# Altium project Auxiliary PDU.PrjPcb
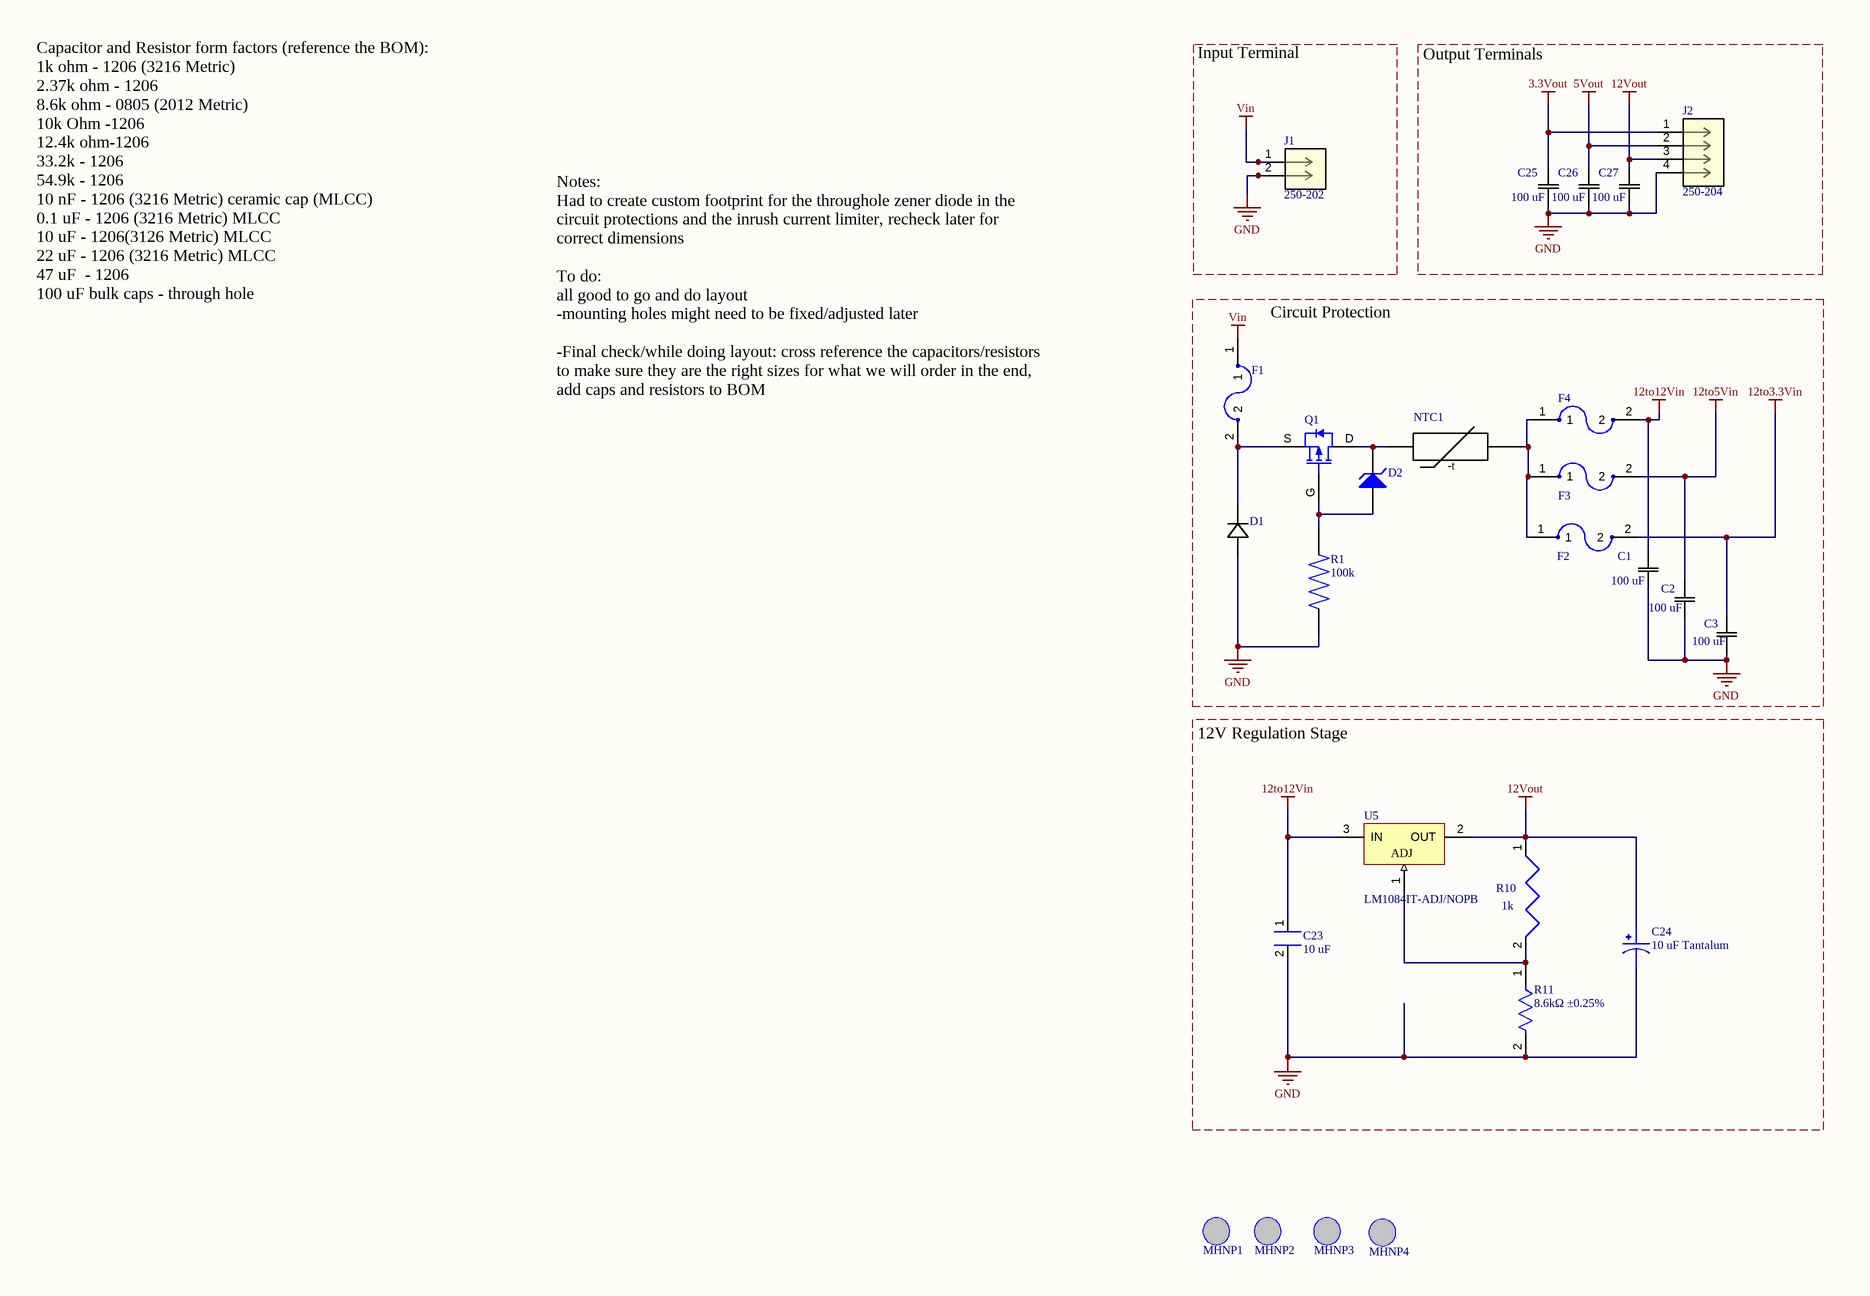
[diagram p0: AuxPDU.SchDoc, left]
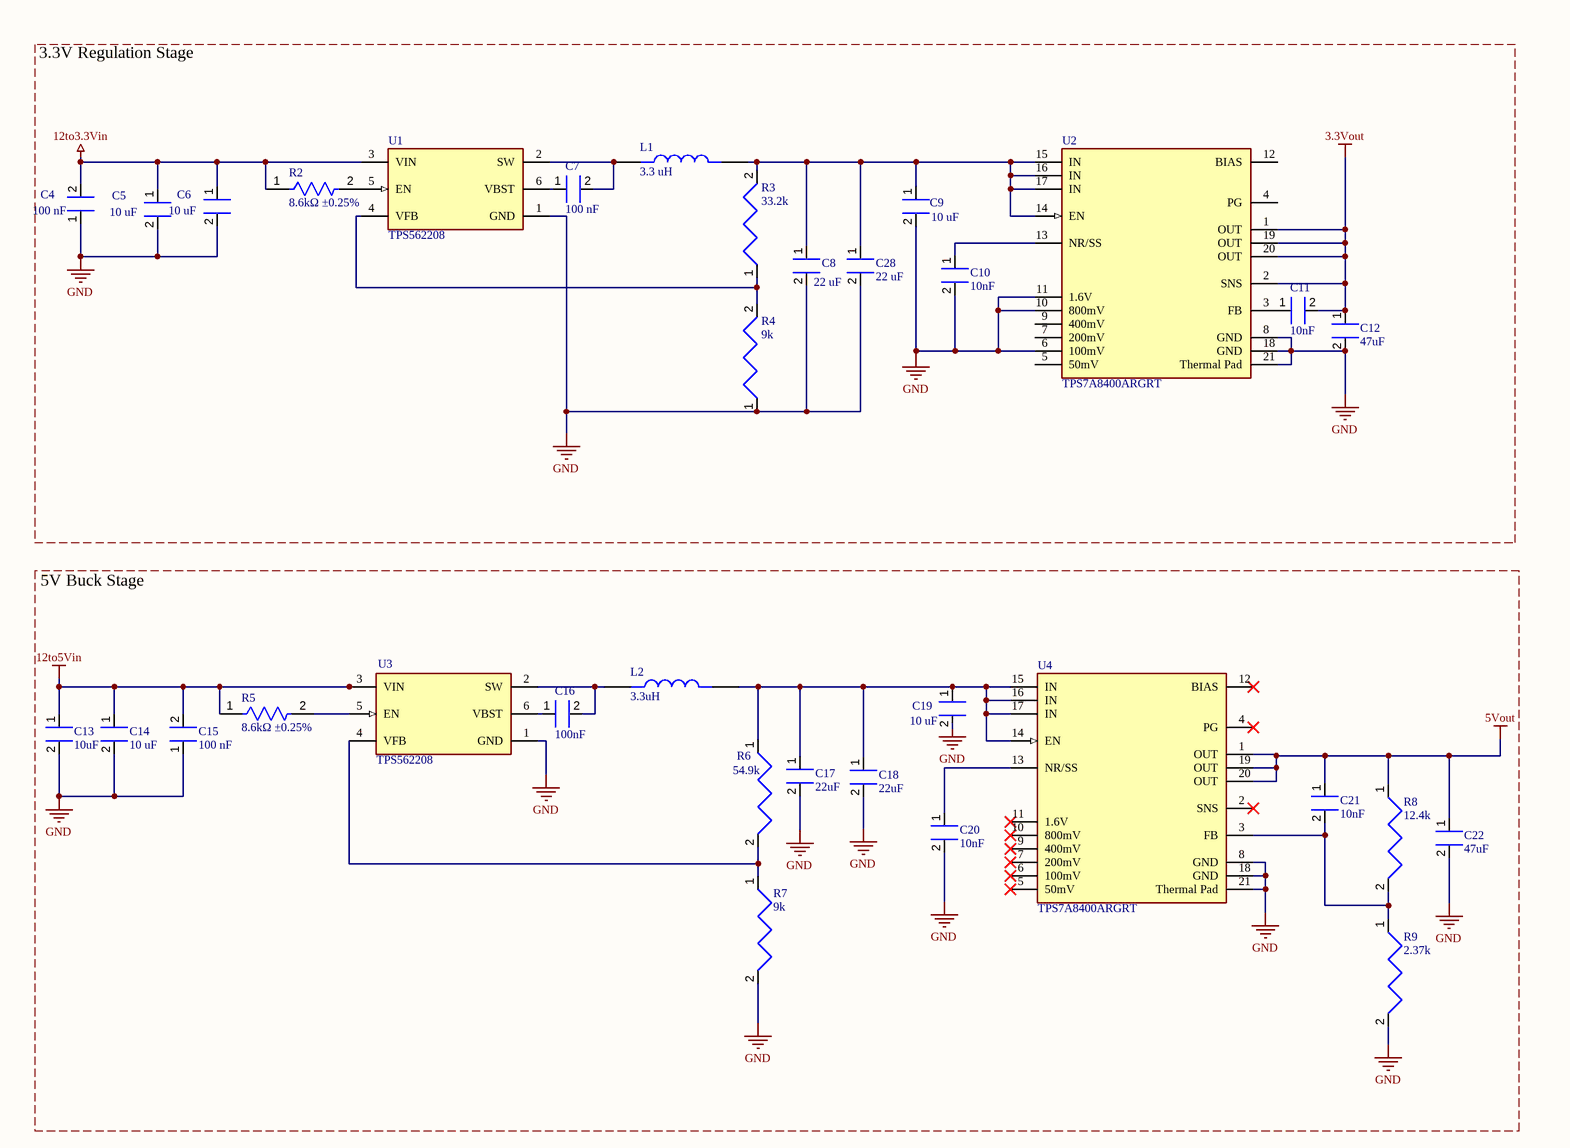
[diagram p1: AuxPDU.SchDoc, right]
1 sheet, 60 parts. Net scope: global (net labels, ports and power ports of the same name join across sheets).
Board files: AuxPDU_PatricksDesign.PcbDoc, AuxPDU.PcbDoc

## Sheet AuxPDU.SchDoc: Auxiliary Power Module
size 431 x 279 mm; Author: Patrick Nguyen , Angel Conde; CompanyName: CPP Solar Boat Club; Revision: A; SheetNumber: 1; SheetTotal: 1

### Parts
C1  100 uF  [CAP_YX_6P3X11_RUB]
C2  100 uF  [CAP_YX_6P3X11_RUB]
C3  100 uF  [CAP_YX_6P3X11_RUB]
C4  100 nF  [Cap 1206]
C5  10 uF  [Cap 1206]
C6  10 uF  [Cap 1206]
C7  100 nF  [Cap 1206]
C8  22 uF  [Cap 1206]
C9  10 uF  [Cap 1206]
C10  10nF  [Cap 1206]
C11  10nF  [Cap 1206]
C12  47uF  [Cap 1206]
C13  10uF  [Cap 1206]
C14  10 uF  [Cap 1206]
C15  100 nF  [Cap 1206]
C16  100nF  [Cap 1206]
C17  22uF  [Cap 1206]
C18  22uF  [Cap 1206]
C19  10 uF  [Cap 1206]
C20  10nF  [Cap 1206]
C21  10nF  [Cap 1206]
C22  47uF  [Cap 1206]
C23  10 uF  [Cap 1206]
C24  10 uF Tantalum  [CAPMP3216X180N]
C25  100 uF  [CAP_YX_6P3X11_RUB]
C26  100 uF  [CAP_YX_6P3X11_RUB]
C27  100 uF  [CAP_YX_6P3X11_RUB]
C28  22 uF  [Cap 1206]
D1  TVS DIODE 14VWM 23.2VC DO214AB  [SMCJSeries_LTF-M]  (value not drawn)
D2  DIODE ZENER 10V 500MW DO35  [BZX79C10]  (value not drawn)
F1  (no value)  [CHIP_2920L_7P98X5P44_LTF-M]
F2  1812L110/33MR  [1812L110_33MR]  (value not drawn)
F3  1812L110/33MR  [1812L110_33MR]  (value not drawn)
F4  (no value)  [CHIP_2920L_7P98X5P44_LTF-M]
J1  250-202  [CONN2_250-202_WAG]
J2  250-204  [CONN4_250-204_WAG]
L1  3.3 uH  [IND_MSS7341-332NLD]
L2  3.3uH  [IND_MSS7341-332NLD]
MHNP1  Mounting Hole Non-Plated 3.2 mm  [MTHNP3P2MM]  (value not drawn)
MHNP2  Mounting Hole Non-Plated 3.2 mm  [MTHNP3P2MM]  (value not drawn)
MHNP3  Mounting Hole Non-Plated 3.2 mm  [MTHNP3P2MM]  (value not drawn)
MHNP4  Mounting Hole Non-Plated 3.2 mm  [MTHNP3P2MM]  (value not drawn)
NTC1  ICL 20 OHM 25% 10A 29MM  [AS3220010]  (value not drawn)
Q1  MOSFET P-CH 50V 9.7A TO220AB  [IRF9Z20PBF]  (value not drawn)
R1  100k  [RESC3116X65N]
R2  8.6kΩ ±0.25%  [FP-RK73G2A-MFG]
R3  33.2k  [Cap 1206]
R4  9k  [Cap 1206]
R5  8.6kΩ ±0.25%  [FP-RK73G2A-MFG]
R6  54.9k  [Cap 1206]
R7  9k  [Cap 1206]
R8  12.4k  [Cap 1206]
R9  2.37k  [Cap 1206]
R10  1k  [Cap 1206]
R11  8.6kΩ ±0.25%  [FP-RK73G2A-MFG]
U1  TPS562208  [TPS562208]
U2  TPS7A8400ARGRT  [TPS7A8400ARGRT]
U3  TPS562208  [TPS562208]
U4  TPS7A8400ARGRT  [TPS7A8400ARGRT]
U5  LM1084IT-ADJ/NOPB  [NDE0003A]

### Blocks framed on the sheet
Input Terminal: J1
Output Terminals: C25-C27 J2
3.3V Regulation Stage: C4-C12 C28 L1 R2-R4 U1 U2
Circuit Protection: C1-C3 D1 D2 F1-F4 NTC1 Q1 R1
5V Buck Stage: C13-C22 L2 R5-R9 U3 U4
12V Regulation Stage: C23 C24 R10 R11 U5

### Nets
3.3Vout: C11.2 C12.1 C25.2 J2.1 U2.1(OUT) U2.2(SNS) U2.19(OUT) U2.20(OUT)
5Vout: C21.1 C22.1 C26.2 J2.2 R8.1 U4.1(OUT) U4.19(OUT) U4.20(OUT)
12to3.3Vin: C3.2 C4.2 C5.1 C6.1 F2.2 R2.1 U1.3(VIN)
12to5Vin: C2.2 C13.1 C14.1 C15.2 F3.2 R5.1 U3.3(VIN)
12to12Vin: C1.2 C23.1 F4.2 U5.3(IN)
12Vout: C24.1 C27.2 J2.3 R10.1 U5.2(OUT)
GND: C1.1 C2.1 C3.1 C4.1 C5.2 C6.2 C8.2 C9.2 C10.2 C12.2 C13.2 C14.2 C15.1 C17.2 C18.2 C19.2 C20.2 C22.2 C23.2 C24.2 C25.1 C26.1 C27.1 C28.2 D1.2 J1.2 J2.4 R1.1 R4.1 R7.2 R9.2 R11.2 U1.1(GND) U2.6(100mV) U2.8(GND) U2.10(800mV) U2.11(1.6V) U2.18(GND) U2.21(Thermal_Pad) U3.1(GND) U4.8(GND) U4.18(GND) U4.21(Thermal_Pad)
Vin: F1.1 J1.1
NetC7_1: C7.1 U1.6(VBST)
NetC7_2: C7.2 L1.1 U1.2(SW)
NetC8_1: C8.1 C9.1 C28.1 L1.2 R3.2 U2.14(EN) U2.15(IN) U2.16(IN) U2.17(IN)
NetC10_1: C10.1 U2.13(NR/SS)
NetC11_1: C11.1 U2.3(FB)
NetC16_1: C16.1 U3.6(VBST)
NetC16_2: C16.2 L2.1 U3.2(SW)
NetC17_1: C17.1 C18.1 C19.1 L2.2 R6.1 U4.14(EN) U4.15(IN) U4.16(IN) U4.17(IN)
NetC20_1: C20.1 U4.13(NR/SS)
NetC21_2: C21.2 R8.2 R9.1 U4.3(FB)
NetD1_1: D1.1 F1.2 Q1.S(SOURCE)
NetD2_1: D2.1(A) Q1.G(GATE) R1.2
NetD2_2: D2.2(K) NTC1.1 Q1.D(DRAIN)
NetF2_1: F2.1 F3.1 F4.1 NTC1.2
NetR2_2: R2.2 U1.5(EN)
NetR3_1: R3.1 R4.2 U1.4(VFB)
NetR5_2: R5.2 U3.5(EN)
NetR6_2: R6.2 R7.1 U3.4(VFB)
NetR10_2: R10.2 R11.1 U5.1(ADJ)

Not connected (* = marked no-connect by the designer): U2 4(PG) 5(50mV) 7(200mV) 9(400mV) 12(BIAS); U4 2(SNS)* 4(PG)* 5(50mV)* 6(100mV)* 7(200mV)* 9(400mV)* 10(800mV)* 11(1.6V)* 12(BIAS)*

### Notes on the sheet
- Capacitor and Resistor form factors (reference the BOM):
  1k ohm - 1206 (3216 Metric)
  2.37k ohm - 1206
  8.6k ohm - 0805 (2012 Metric)
  10k Ohm -1206
  12.4k ohm-1206
  33.2k - 1206
  54.9k - 1206
  10 nF - 1206 (3216 Metric) ceramic cap (MLCC)
  0.1 uF - 1206 (3216 Metric) MLCC
  10 uF - 1206(3126 Metric) MLCC
  22 uF - 1206 (3216 Metric) MLCC
  47 uF  - 1206
  100 uF bulk caps - through hole
- Notes:
  Had to create custom footprint for the throughole zener diode in the circuit protections and the inrush current limiter, recheck later for correct dimensions
  To do:
  all good to go and do layout
  -mounting holes might need to be fixed/adjusted later
  -Final check/while doing layout: cross reference the capacitors/resistors to make sure they are the right sizes for what we will order in the end, add caps and resistors to BOM
- DWG. NO.
- REV.
- SHT.
- THIS DOCUMENT AND THE DATA DISCLOSED HEREIN OR HEREWITH IS THE PROPERTY OF ALTIUM LIMITED AND MAY BE FREELY DISTRIBUTED IN WHOLE. NO RIGHTS ARE RESERVED OR EXPRESS OR IMPLIED WARANTEE GIVEN.
- REVISION
- DESCRIPTION
- DATE
- APPROVED
- ENG:
- APPROVALS
- PROJECT
- DSN:
- CHK:
- REFERENCE DOCUMENTS
- PROJECT REVISION:
- TITLE
- DOCUMENT REVISION:
- DESIGN ITEM:
- BOM:
- FAB DWG:
- PCB DWG:
- ASSY DWG:
- SCALE:
- SIZE
- B
- CAGE CODE
- FILE NAME
- DWG NO.
- SHEET
- OF
- REV
- (in symbol AS3220010) -t

### Library data of the parts
C1-C3 C25-C27 = 35ZLH100MEFC6.3X11: 100 uF electrolytic capacitor; Manufacturer_Name: Rubycon; Copyright: Copyright (C) 2025 Ultra Librarian. All rights reserved.; Manufacturer_Part_Number: 35ZLH100MEFC6.3X11
C4-C23 C28 = Cap 1206: Generic SMD capacitor with 1206 package (3216 metric)
C24 = TAJA106K016RNJ: 10 ÂµF Molded Tantalum Capacitors 16 V 1206 (3216 Metric) 3Ohm; MF: KYOCERA AVX; SnapEDA_Link: https://www.snapeda.com/parts/TAJA106K016RNJ/Kyocera/view-part/?ref=snap; Package: 1206 AVX; Value: *; MP: TAJA106K016RNJ; Check_prices: https://www.snapeda.com/parts/TAJA106K016RNJ/Kyocera/view-part/?ref=eda
D1 = SMCJ14A: Unidirectional
D2 = BZX79C10: ComponentLink1Description: New link; ComponentLink1URL: *; Supplier 1: DigiKey; Supplier Part Number 1: BZX79C10-ND
F1 F4 = 2920L150DR: Description; Manufacturer_Name: Littelfuse Inc; Copyright: Copyright (C) 2025 Ultra Librarian. All rights reserved.; Manufacturer_Part_Number: 2920L150DR; RefDes: RefDes; Type: Type
F2 F3 = 1812L110/33MR: MF: {'manufacturer': u'Littelfuse Inc.'}; Package: None; Price: None; Value: *; MP: 1812L110/33MR; Availability: Unavailable
J1 = 250-202: Description; Manufacturer_Name: Wago; Copyright: Copyright (C) 2025 Ultra Librarian. All rights reserved.; Manufacturer_Part_Number: 250-202; RefDes: RefDes; Type: Type
J2 = 250-204: Description; Manufacturer_Name: Wago; Copyright: Copyright (C) 2025 Ultra Librarian. All rights reserved.; Manufacturer_Part_Number: 250-204; RefDes: RefDes; Type: Type
L1 L2 = MSS7341-332NLD: 3.3 ÂµH Shielded Drum Core Inductor 3.95 A 18mOhm Max Nonstandard; MF: Coilcraft; SnapEDA_Link: https://www.snapeda.com/parts/MSS7341-332NLD/Coilcraft/view-part/?ref=snap; Package: None; Value: *; MP: MSS7341-332NLD; Check_prices: https://www.snapeda.com/parts/MSS7341-332NLD/Coilcraft/view-part/?ref=eda
MHNP1-MHNP4 = MTHNP3P2MM
NTC1 = AS3220010: Supplier 1: DigiKey; Supplier Part Number 1: 570-AS3220010-ND
Q1 = IRF9Z20PBF: ComponentLink1Description: New link; ComponentLink1URL: *; Supplier 1: Newark; Supplier Part Number 1: IRF9Z20PBF; Supplier 2: DigiKey; Supplier Part Number 2: IRF9Z20PBF-ND
R1 = RC1206FR-10100KL: MF: {'manufacturer': u'YAGEO'}; Package: None; Price: None; Value: *; MP: RC1206FR-10100KL; Availability: Unavailable
R2 R5 R11 = CMP-04015-106177-1: 8.06kΩ ±0.25% 0.125W Chip Resistor 0805 Thick Film AEC-Q200 Qualified; RoHS Compliant: Yes
R3 R4 R6-R10 = Res 1206: Generic SMD resistor with 1206 package (3216 metric)
U1 U3 = TPS562208: Buck Switching Regulator IC Positive Adjustable 0.768V 1 Output 2A SOT-23-6 Thin, TSOT-23-6
U2 U4 = TPS7A8400ARGRT: Linear Voltage Regulator IC Positive Adjustable/Programmable 1 Output 3A
U5 = CMP-0062-02529-3: 5A Low Dropout Positive Regulators, 3-pin TO-220, Pb-Free; Manufacturer: Texas Instruments; CompType: LDO IC; PackageTopMarking: NSUZXYTTE#*LM1084*IT-ADJ; PowerWise: N; ComponentLink1Description: Datasheet URL; ComponentLink1URL: http://www.ti.com/general/docs/lit/getliterature.tsp?genericPartNumber=LM1084&fileType=pdf; PackageDescription: TO-220, Molded, 3 Lead, Straight; PinCount: 3; PackageReference: NDE0003A; RoHS: Y